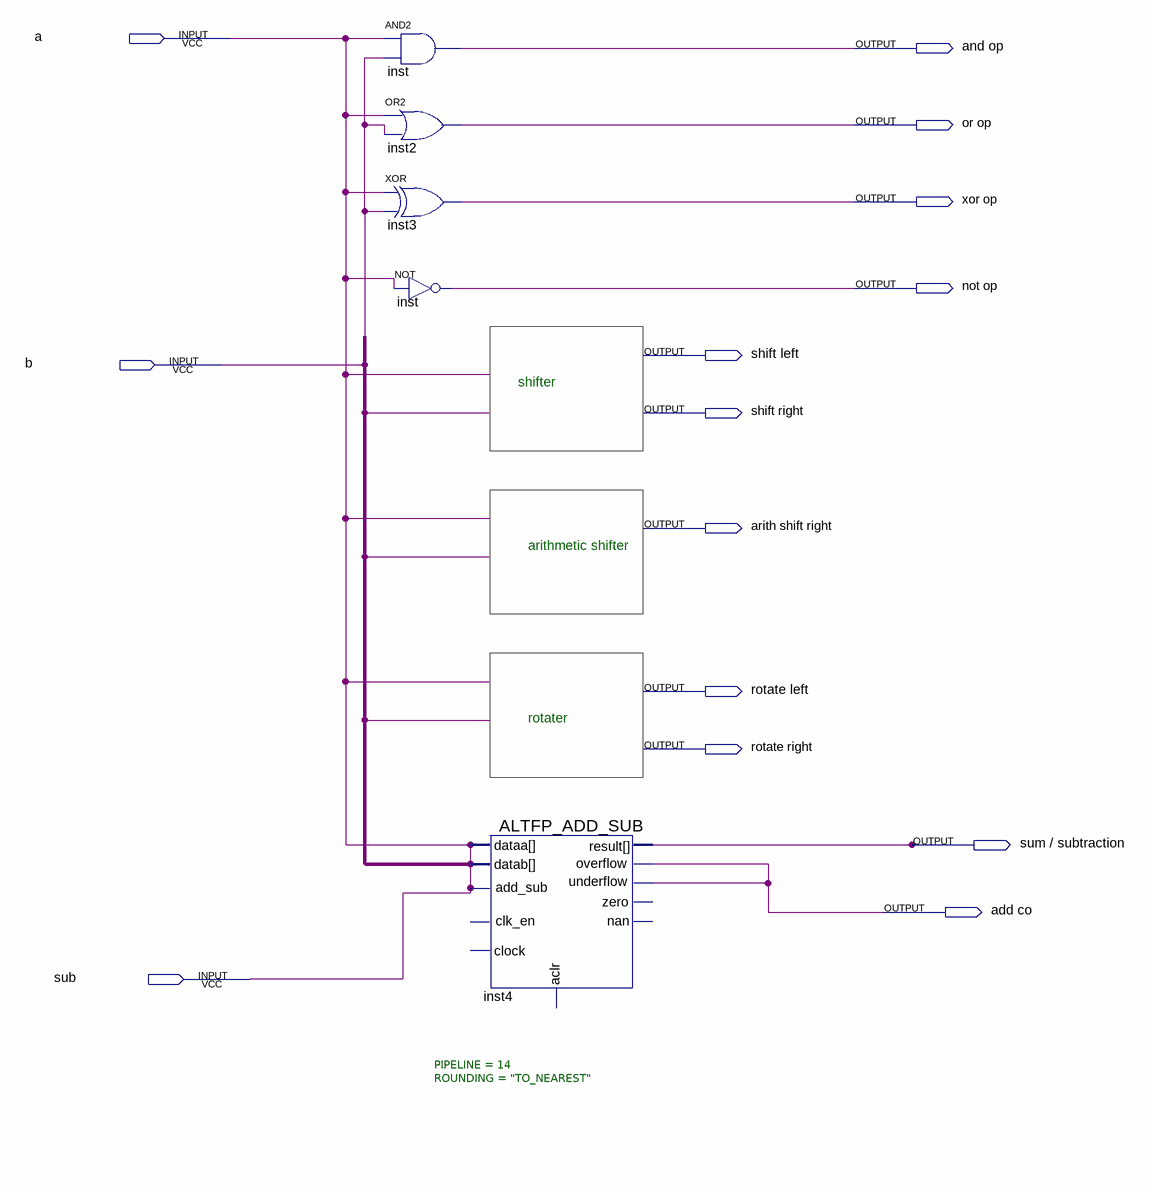
[diagram p0: schematic sheet]
// Quartus schematic Block1.bdf as structural Verilog: 5 symbols, 14 pins
module Block1 (
  input  a,
  input  b,
  input  sub,
  output \and_op ,
  output \or_op ,
  output \xor_op ,
  output \not_op ,
  output \shift_left ,
  output \shift_right ,
  output \arith_shift_right ,
  output \rotate_left ,
  output \rotate_right ,
  output \sum_/_subtraction ,
  output \add_co 
);

  and inst (\and_op , a, a);
  or inst2 (\or_op , a, a);
  xor inst3 (\xor_op , a, a);
  not inst_dup2 (\not_op , a);
  ALTFP_ADD_SUB #(.PIPELINE(14), .ROUNDING("TO_NEAREST")) inst4 (
    .dataa(a), .datab(a), .add_sub(a), .overflow(\add_co ), .underflow(\add_co ), .result(\sum_/_subtraction ));  // open: clk_en, clock, aclr, zero, nan

  assign sub = a;

  // Notes on the sheet:
  //   shifter
  //   arithmetic shifter
  //   rotater
endmodule
